# Altium schematic sheet Pressure_Sensor.SchDoc
size A4
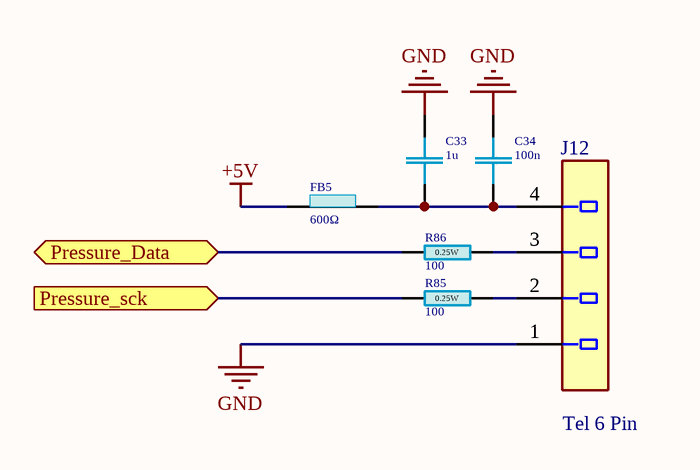
[diagram p0: Pressure_Sensor.SchDoc]

## Parts
C33  1u  [C1206]
C34  100n  [C1206]
FB5  ZTyp@100MHz: 600Ω  [L1206]  (hidden comment: 0.955u)
J12  Tel 6 Pin  [TE_640454-4_0]
R85  100  [R1206]
R86  100  [R1206]

## Ports
Pressure_Data (bidir), Pressure_sck (in)

## Nets
+5V: FB5.1
GND: C33.2 C34.1 J12.1
Pressure_Data: R86.1 ; port Pressure_Data
Pressure_sck: R85.1 ; port Pressure_sck
NetC33_1: C33.1 C34.2 FB5.2 J12.4
NetJ12_2: J12.2 R85.2
NetJ12_3: J12.3 R86.2

## Library data of the parts
C33 C34 = C 1206  100V X7R - 100n: SMD 1206   100V X7R 10%; Part Number: CL31B104KCFNNNE; Manufacturer: Samsung; TYPE: Capacitors; VDC: 16V; Package-mm: 3216; Mount Type: SMT; Publisher: Hefest; Manufacturer Alternate: *; Part Number Alternate: *; Published: 07.04.2019; Supplier 1: Comet; Supplier Part Number 1: C1206 100nF 100V X7R SAMSUNG; RoHS: Y; Technology: Ceramic  MLCC; Package: 1206; TempCo: X7R; Tolerance %: ±10%; VAC: *; ESR Ohm: *; ComponentLink1Description: Datasheet Link; ComponentLink1URL: https://store.comet.bg/download-file.php?id=11; Temperature Range: -55°C ~ +125°C; Price: 0.090; ComponentLink2Description: Characteristics data; ComponentLink2URL: https://store.comet.bg/download-file.php?id=3821
  C33: Value: 1u
  C34: Value: 100n
FB5 = FB BLM31P 600: SMD 1206 1.5A 600Ω/80mΩ; Part Number: BLM31PG601SN1L; Manufacturer: Murata; TYPE: Ferrite Bead; Ind: 0.955uH; DC Resistance: 80mΩ; Material: Ferrite; Package-mm: 3216; Tolerance %: ±25%; Temperature Range: -55°C ~ +125°C; Imax: 1.5A; Irms: *; Isat: *; Technology: Chip; Published: 07.04.2019; Publisher: Hefest; Mount Type: SMT; Package: 1206; ComponentLink1Description: Datasheet Link; ComponentLink1URL: https://store.comet.bg/download-file.php?id=5324; RoHS: Y; Ztyp@1GHz: *; Manufacturer Alternate: *; Supplier 1: Comet; Supplier Part Number 1: BLM31PG601SN1L; Part Number Alternate: *; Price: 0.161; Value: 0.955u
J12 = Conn_TE_640454-4_eec: CONN 4 Positions Header, Unshrouded Connector 0.100" (2.54mm) Through Hole Tin; Manufacturer: TE; Part Number: 640454-4; helpURL: https://upverter.com/upn/revision/6b0ee12ed291c9c0/; ComponentLink2Description: Datasheet; Temperature: -55°C to +105°C; Package: HDR4; Supplier 2: Mouser; Price: 0.112358212788; Supplier 1: Digi-Key; ComponentLink1URL: https://upverter.com/upn/revision/6b0ee12ed291c9c0/; Supplier Part Number 2: 571-6404544; Supplier Part Number 1: A19431-ND; ComponentLink1Description: Upverter; ComponentLink2URL: http://datasheet.octopart.com/640454-4-TE-Connectivity---AMP-datasheet-26529718.pdf; RoHS: TRUE; Mouser Part Number: 571-6404544; Temperature Range High: +105°C; Digikey Description: CONN 4 Positions Header, Unshrouded Connector 0.100" (2.54mm) Through Hole Tin; Digikey Part Number: A19431-ND; Temperature Range Low: -55°C; Lead Free: yes
R85 R86 = R 1206-5%: SMD 1206 0.25W   5% 200V; Manufacturer: YAGEO; TempCo: ±100ppm/°C; Package-mm: 3216; Value Code: 102; Part Number: *; Mount Type: SMT; Publisher: Hefest; Manufacturer Alternate: *; Published: 07.04.2019; Supplier 1: Comet; Supplier Part Number 1: R1206 1.0K 5% YAG/ASJ; RoHS: Y; Technology: Thick film; Package: 1206; VDC: 200V; Tolerance %: ±5%; ComponentLink1Description: Datasheet Link; ComponentLink1URL: https://store.comet.bg/download-file.php?id=140; Temperature Range: -55°C ~ +155°C; Price: 0.054; Part Number Alternate: *; TYPE: Resistor; Power: 0.25W; Value: 100